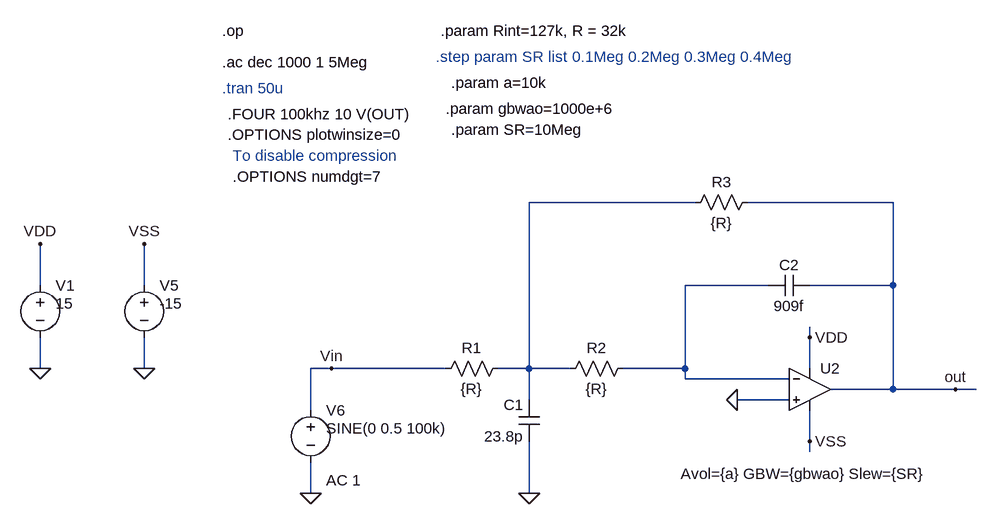
[diagram p0: schematic FTJ_Rauch.asc]
FTJ_Rauch.asc, the LTspice schematic file:
Version 4
SHEET 1 4436 1708
WIRE 3936 -112 3680 -112
WIRE 4240 -112 4016 -112
WIRE 2928 16 2928 -48
WIRE 3088 16 3088 -48
WIRE 4048 16 3920 16
WIRE 4240 16 4240 -112
WIRE 4240 16 4112 16
WIRE 4112 96 4112 80
WIRE 2928 144 2928 96
WIRE 3088 144 3088 96
WIRE 3376 144 3344 144
WIRE 3552 144 3376 144
WIRE 3680 144 3680 -112
WIRE 3680 144 3632 144
WIRE 3744 144 3680 144
WIRE 3920 144 3920 16
WIRE 3920 144 3824 144
WIRE 4112 144 4112 96
WIRE 3920 160 3920 144
WIRE 4080 160 3920 160
WIRE 4240 176 4240 16
WIRE 4240 176 4144 176
WIRE 4336 176 4240 176
WIRE 4368 176 4336 176
WIRE 3680 192 3680 144
WIRE 4080 192 4000 192
WIRE 3344 208 3344 144
WIRE 4112 256 4112 208
WIRE 4112 272 4112 256
WIRE 3344 336 3344 288
WIRE 3680 336 3680 256
FLAG 4336 176 out
FLAG 2928 144 0
FLAG 3088 144 0
FLAG 2928 -48 VDD
FLAG 3088 -48 VSS
FLAG 3344 336 0
FLAG 3376 144 Vin
FLAG 4112 256 VSS
FLAG 4112 96 VDD
FLAG 3680 336 0
FLAG 4000 192 0
DATAFLAG 3712 144 ""
DATAFLAG 3968 160 ""
DATAFLAG 4208 176 ""
SYMBOL cap 4112 0 R90
WINDOW 0 0 32 VBottom 2
WINDOW 3 32 32 VTop 2
SYMATTR InstName C2
SYMATTR Value 909f
SYMBOL res 3648 128 R90
WINDOW 0 0 56 VBottom 2
WINDOW 3 32 56 VTop 2
SYMATTR InstName R1
SYMATTR Value {R}
SYMBOL res 3840 128 R90
WINDOW 0 0 56 VBottom 2
WINDOW 3 32 56 VTop 2
SYMATTR InstName R2
SYMATTR Value {R}
SYMBOL cap 3696 256 R180
WINDOW 0 24 56 Left 2
WINDOW 3 24 8 Left 2
SYMATTR InstName C1
SYMATTR Value 23.8p
SYMBOL res 4032 -128 R90
WINDOW 0 0 56 VBottom 2
WINDOW 3 32 56 VTop 2
SYMATTR InstName R3
SYMATTR Value {R}
SYMBOL voltage 2928 0 R0
WINDOW 123 24 124 Left 2
WINDOW 39 0 0 Left 2
WINDOW 3 24 44 Left 2
SYMATTR Value 15
SYMATTR InstName V1
SYMBOL voltage 3088 0 R0
WINDOW 123 24 124 Left 2
WINDOW 39 0 0 Left 2
WINDOW 3 24 44 Left 2
SYMATTR Value -15
SYMATTR InstName V5
SYMBOL voltage 3344 192 R0
WINDOW 123 24 124 Left 2
WINDOW 39 0 0 Left 2
WINDOW 3 24 44 Left 2
SYMATTR Value2 AC 1
SYMATTR Value SINE(0 0.5 100k)
SYMATTR InstName V6
SYMBOL Opamps\\UniversalOpamp2 4112 176 R0
WINDOW 123 -199 130 Left 2
SYMATTR Value2 Avol={a} GBW={gbwao} Slew={SR}
SYMATTR InstName U2
TEXT 3208 -328 Left 2 !.ac dec 1000 1 5Meg
TEXT 3552 -256 Left 2 !.param gbwao=1000e+6
TEXT 3208 -376 Left 2 !.op
TEXT 3544 -376 Left 2 !.param Rint=127k, R = 32k
TEXT 3208 -288 Left 2 ;.tran 50u
TEXT 3560 -296 Left 2 !.param a=10k
TEXT 3560 -224 Left 2 !.param SR=10Meg
TEXT 3216 -248 Left 2 !.FOUR 100khz 10 V(OUT)
TEXT 3216 -216 Left 2 !.OPTIONS plotwinsize=0
TEXT 3224 -184 Left 2 ;To disable compression
TEXT 3224 -152 Left 2 !.OPTIONS numdgt=7
TEXT 3536 -336 Left 2 ;.step param SR list 0.1Meg 0.2Meg 0.3Meg 0.4Meg

The netlist it stands for:
* FTJ_Rauch.asc
C2 out N002 909f
R1 N001 Vin {R}
R2 N002 N001 {R}
C1 0 N001 23.8p
R3 out N001 {R}
V1 VDD 0 15
V5 VSS 0 -15
V6 Vin 0 SINE(0 0.5 100k) AC 1
XU2 0 N002 VDD VSS out level.2 Avol={a} GBW={gbwao} Slew={SR} ilimit=25m rail=0 Vos=0 phimargin=45 en=0 enk=0 in=0 ink=0 Rin=500Meg  ; pins IN+ IN- V+ V- OUT
.ac dec 1000 1 5Meg
.param gbwao=1000e+6
.op
.param Rint=127k, R = 32k
* .tran 50u
.param a=10k
.param SR=10Meg
.FOUR 100khz 10 V(OUT)
.OPTIONS plotwinsize=0
* To disable compression
.OPTIONS numdgt=7
* .step param SR list 0.1Meg 0.2Meg 0.3Meg 0.4Meg
.lib UniversalOpamps2.sub
.backanno
.end